# Altium schematic sheet USB-ESP32.SchDoc
size B
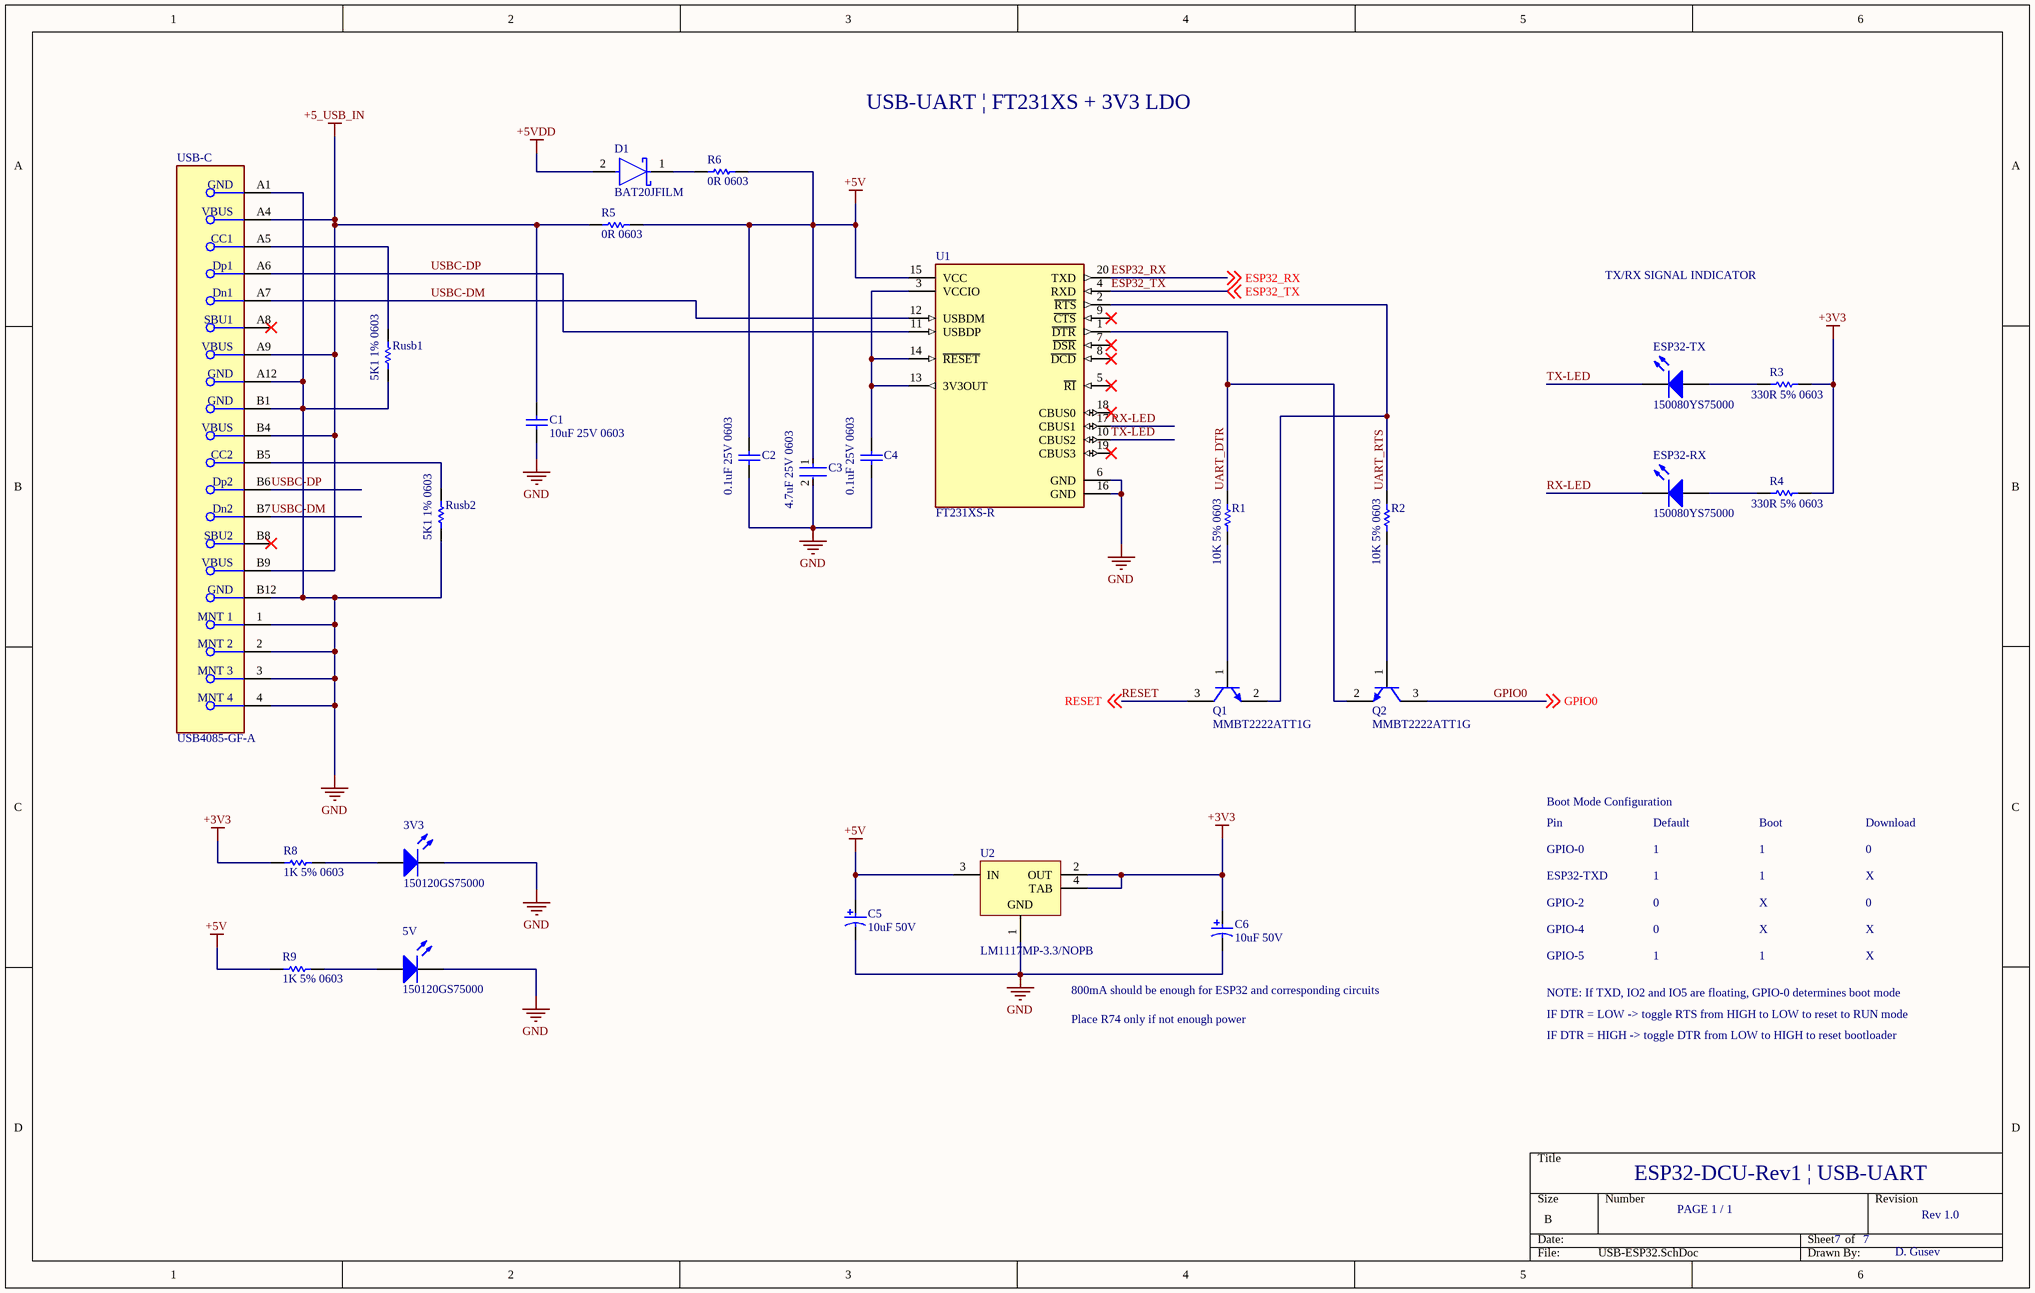
[diagram p0: USB-ESP32.SchDoc]

## Parts
3V3  150120GS75000  [1206_A]
5V  150120GS75000  [1206_A]
C1  10uF 25V 0603  [CAPC1608X100X20VL10T10]
C2  0.1uF 25V 0603  [CAPC1608X90X35LL10T15]
C3  4.7uF 25V 0603  [FP-GRM188-0_15-IPC_C]
C4  0.1uF 25V 0603  [CAPC1608X90X35LL10T15]
C5  10uF 50V  [PNSC-FK-V-D_V]
C6  10uF 50V  [PNSC-FK-V-D_V]
D1  BAT20JFILM  [FP-BAT20JFILM-MFG]
ESP32-RX  150080YS75000  [0805_A]
ESP32-TX  150080YS75000  [0805_A]
Q1  MMBT2222ATT1G  [ONSC-SC-75-3-463-01_V]
Q2  MMBT2222ATT1G  [ONSC-SC-75-3-463-01_V]
R1  10K 5% 0603  [RESC1608X55X25ML10T15]
R2  10K 5% 0603  [RESC1608X55X25ML10T15]
R3  330R 5% 0603  [RESC1608X55X25NL10T15]
R4  330R 5% 0603  [RESC1608X55X25NL10T15]
R5  0R 0603  [RESC1608X55X25ML10T15]
R6  0R 0603  [RESC1608X55X25ML10T15]
R8  1K 5% 0603  [RESC1608X55X25NL10T15]
R9  1K 5% 0603  [RESC1608X55X25NL10T15]
Rusb1  5K1 1% 0603  [RESC1608X55X25ML10T15]
Rusb2  5K1 1% 0603  [RESC1608X55X25ML10T15]
U1  FT231XS-R  [FP-SSOP-20-MFG]
U2  LM1117MP-3.3/NOPB  [DCY0004A_L]
USB-C  USB4085-GF-A  [FP-USB4085-GF-A-MFG]

## Nets
+3V3: C6.1 R3.2 R4.2 R8.1 U2.2(OUT) U2.4(TAB)
+5_USB_IN: C1.2 R5.1 USB-C.A4(VBUS) USB-C.A9(VBUS) USB-C.B4(VBUS) USB-C.B9(VBUS)
+5V: C2.2 C3.1 C5.1 R5.2 R6.2 R9.1 U1.15(VCC) U2.3(IN)
+5VDD: D1.2(A)
GND: 3V3.1(K) 5V.1(K) C1.1 C2.1 C3.2 C4.1 C5.2 C6.2 Rusb1.1 Rusb2.1 U1.6(GND) U1.16(GND) U2.1(GND) USB-C.1(MNT_1) USB-C.2(MNT_2) USB-C.3(MNT_3) USB-C.4(MNT_4) USB-C.A1(GND) USB-C.A12(GND) USB-C.B1(GND) USB-C.B12(GND)
ESP32_RX: U1.20(TXD) ; off-sheet ESP32_RX
ESP32_TX: U1.4(RXD) ; off-sheet ESP32_TX
GPIO0: Q2.3(C) ; off-sheet GPIO0
RESET: Q1.3(C) ; off-sheet RESET
RX-LED: ESP32-RX.1(K) U1.17(CBUS1)
TX-LED: ESP32-TX.1(K) U1.10(CBUS2)
UART_DTR: Q2.2(E) R1.2 U1.1(~{DTR})
UART_RTS: Q1.2(E) R2.2 U1.2(~{RTS})
USBC-DM: U1.12(USBDM) USB-C.A7(Dn1) USB-C.B7(Dn2)
USBC-DP: U1.11(USBDP) USB-C.A6(Dp1) USB-C.B6(Dp2)
Net3V3_2: 3V3.2(A) R8.2
Net5V_2: 5V.2(A) R9.2
NetC4_2: C4.2 U1.3(VCCIO) U1.13(3V3OUT) U1.14(~{RESET})
NetD1_1: D1.1(K) R6.1
NetESP32-RX_2: ESP32-RX.2(A) R4.1
NetESP32-TX_2: ESP32-TX.2(A) R3.1
NetQ1_1: Q1.1(B) R1.1
NetQ2_1: Q2.1(B) R2.1
NetRusb1_2: Rusb1.2 USB-C.A5(CC1)
NetRusb2_2: Rusb2.2 USB-C.B5(CC2)

Not connected (* = marked no-connect by the designer): U1 5(~{RI})* 7(~{DSR})* 8(~{DCD})* 9(~{CTS})* 18(CBUS0)* 19(CBUS3)*; USB-C A8(SBU1)* B8(SBU2)*

## Notes on the sheet
- USB-UART | FT231XS + 3V3 LDO
- TX/RX SIGNAL INDICATOR
- Boot Mode Configuration
- Pin
- Default
- Boot
- Download
- GPIO-0
- ESP32-TXD
- GPIO-2
- 1
- 0
- X
- GPIO-4
- GPIO-5
- 800mA should be enough for ESP32 and corresponding circuits
- Place R74 only if not enough power
- NOTE: If TXD, IO2 and IO5 are floating, GPIO-0 determines boot mode
- IF DTR = LOW -> toggle RTS from HIGH to LOW to reset to RUN mode
- IF DTR = HIGH -> toggle DTR from LOW to HIGH to reset bootloader
- ESP32-DCU-Rev1 | USB-UART
- PAGE 1 / 1
- 7
- Rev 1.0
- D. Gusev

## Library data of the parts
3V3 5V = CMP-1426-00014-1: SMD mono-color Chip LED, WL-SMCW, Green; Manufacturer: Wuerth Elektronik; PackageReference: 1206_A; PartNumber: 150120GS75000; ComponentLink1Description: Manufacturer URL; ComponentLink2URL: http://katalog.we-online.com/led/datasheet/150120GS75000.pdf; ComponentLink2Description: Datasheet; Color: Green; ComponentLink1URL: http://www.we-online.com
C1 = CMP-2000-05442-1: Chip Capacitor, 10 uF, +/- 20%, 25 V, -55 to 85 degC, 0603 (1608 Metric), RoHS, Tape and Reel; Manufacturer: TDK; PCN Part Number: MLCCPartNumberChange30/Nov/2012; Other Names: 445-9015-1; Capacitance: 10µF; Design Resources: 20WNon-IsolatedBuckLEDDriverUsingPLLNK460KG; Kits: 445-9014-KIT-ND-KITMLCC100PF-22UF060310-50V; Product Training Modules: SEAT,CCV,andTVCLDesignToolsGuidetoReplacinganElectrolyticCapacitorwithanMLCC; Online Catalog: CSeries,GeneralPurpose; Temperature Coefficient: X5R; Package Description: 2-Pin Surface Mount Device, Body 1.6 x 0.8 mm; Lead Style: -; Datasheet URL: http://download.siliconexpert.com/pdfs/2016/2/22/9/40/35/949/tdk_/manual/8010476609961980104703407078c1608x5r1e106m080ac.pdf.pdf; Category: Capacitors; Package / Case: 0603(1608Metric); Packaging: CutTape(CT); Series: C; Features: -; Family: CeramicCapacitors; Standard Package: 1; Tolerance: ±20%; Operating Temperature: -55degC~85degC; Mounting Type: SurfaceMount,MLCC; Ratings: -; Size / Dimension: 0.063"Lx0.031"W(1.60mmx0.80mm); Applications: GeneralPurpose; Package Reference: 1608; RoHS Information: RoHSCertificate-MLCC; Manufacturer URL: http://www.tdk.com/; Datasheet Version: Feb-16; Voltage - Rated: 25V; Height - Seated (Max): -; Thickness (Max): 0.039"(1.00mm); Lead Spacing: -
C2 C4 = CMP-2006-02868-1: Part Number: GRM188R71E104KA01D; Manufacturer: Murata
C3 = CMP-2006-02523-2: Chip Multilayer Ceramic Capacitors for General Purpose, 0603, 4.7uF, X5R, 15%, 10%, 25V; Case Code (Metric): 1608; Max Operating Temperature: 85°C; REACH SVHC: No SVHC; Voltage Rating: 25V; Dielectric: X5R; Packaging: Cut Tape; Width: 0.031inch; Min Operating Temperature: -55°C; Lead Free: Lead Free; Capacitance: 4.7uF; Height: 0.8mm; Case Code (Imperial): 0603; Length: 1.6mm; Voltage Rating (DC): 25V; Case/Package: 0603; Voltage: 25V; Tolerance: 10%; Thickness: 0.031inch; Mount: Surface Mount; Material: Ceramic; Package Quantity: 4000; Depth: 0.8mm
C5 C6 = CMP-2000-06207-1: Aluminum Electrolytic Capacitor, 10 uF, +/- 20%, 50 V, 2-Pin SMD (Size Code D), -55 to 105 degC, RoHS, Tape and Reel; Manufacturer: Panasonic; Lifetime@Temperature: 2000Hrs@105°C; Type: Can; Ripple Current: 165mA; Impedance: 0.88O; Capacitance: 10µF; Manufacturer URL: http://www.panasonic.com/; Mounting Technology: SurfaceMount; Rated Voltage: 50V; Datasheet URL: http://industrial.panasonic.com/cdbs/www-data/pdf/RDE0000/ABA0000C1181.pdf; Package Reference: FK-V-D; Series: FK; Operating Temp Range: -55to+105°C; Operating Temp-Max: 105°C; Datasheet Version: 03/2016; Package URL: http://industrial.panasonic.com/cdbs/www-data/pdf/RDE0000/DME0000COL48.pdf; Case Size/Dimension: Ø6.3x5.8mm; Package Description: 2-Pin Electrolytic Aluminum Capacitor, Body 6.6 x 6.6 mm
D1 = CMP-12187-000030-1: DIODE SCHOTTKY 23V 1A SOD323; Polarity: Standard; Element Configuration: Single; Capacitance: 30pF; Forward Voltage: 620mV; Max Surge Current: 5A; Peak Reverse Current: 12uA; Packaging: Tape and Reel; Weight: 0.01lb; Output Current: 1A; Lead Free: Lead Free; Forward Current: 1A; Mount: Surface Mount; Max Reverse Voltage (DC): 23V; Average Rectified Current: 1A; Max Operating Temperature: 150°C; Max Forward Surge Current (Ifsm): 5A; REACH SVHC: No SVHC; Current Rating: 1A; Length: 1.8mm; Radiation Hardening: No; Max Reverse Leakage Current: 12uA; Voltage Rating (DC): 23V; Height: 1.03mm; Peak Non-Repetitive Surge Current: 5A; Max Repetitive Reverse Voltage (Vrrm): 23V; Min Operating Temperature: -65°C; Number of Pins: 2; Width: 1.35mm; Package Quantity: 1
ESP32-RX ESP32-TX = CMP-1426-00012-1: SMD mono-color Chip LED, WL-SMCW, Yellow; Manufacturer: Wuerth Elektronik; Color: Yellow; ComponentLink1URL: http://www.we-online.com; PackageReference: 0805_A; ComponentLink2URL: http://katalog.we-online.com/led/datasheet/150080YS75000.pdf; ComponentLink1Description: Manufacturer URL; ComponentLink2Description: Datasheet; PartNumber: 150080YS75000
Q1 Q2 = CMP-1048-00417-1: General Purpose Transistor, NPN Silicon, 3-Pin SC-75, Pb-Free, Tape and Reel; Manufacturer: On Semiconductor; IC Continuous (A): 0.6; fT Min (MHz): 300; DatasheetVersion: Rev. 5; PackageVersion: Rev. F, 07/2005; ComponentLink1Description: Manufacturer URL; RoHS: TRUE; Packing: Tape and Reel; ComponentLink3URL: http://www.onsemi.com/pub_link/Collateral/463-01.PDF; ComponentLink1URL: http://www.onsemi.com/; ComponentLink3Description: Package Specification; ComponentLink2URL: http://www.onsemi.cn/pub_link/Collateral/MMBT2222ATT1-D.PDF; Mounting Technology: Surface Mount; PartNumber: MMBT2222ATT1G; ComponentLink2Description: Datasheet; Polarity: NPN; PackageReference: SC-75-3-463-01; PackageDescription: 3-Pin Small Outline Transistor, Body 1.6 x 0.8 mm, Pitch 0.5 mm
R1 R2 = CMP-2100-03664-1: Chip Resistor, 10 KOhm, +/- 1%, 01 W, -55 to 155 degC, 0603 (1608 Metric), RoHS, Tape and Reel; Manufacturer: Yageo; Temperature Coefficient: 100ppm/degreesC; Resistance: 10KOhm; Voltage Rating: 75V; Power Rating: 100mW; Voltage Rating (DC): 50V; Composition: ThickFilm; RoHSCompliant: true; Height: 0.45mm; Lead Free: LeadFree; Case Code (Metric): 1608; Case/Package: 0603; Datasheet Version: Rev. 5, 10/2016; Package Reference: 0603; Depth: 0.8mm; Package Description: 2-Pin Surface Mount Device, Body 1.6 x 0.8 mm; Case Code (Imperial): 0603; Packaging: TapeandReel; Termination: SMD/SMT; Lead Pitch: 0.3mm; Width: 0.8mm; Number of Pins: 2; Length: 1.6mm; REACH SVHC: NoSVHC; Military Standard: Not; Max Operating Temperature: 155degC; Min Operating Temperature: -55degC; Manufacturer URL: http://www.yageo.com/; Datasheet URL: http://www.yageo.com/NewPortal/yageodocoutput?fileName=/pdf/R-Chip/PYu-RC_Group_51_RoHS_L_5.pdf; Weight: 7.1E-05oz; Tolerance: 1%
R3 R4 = CMP-1659-00020-2: Chip Resistor, 330 Ohm, +/- 1%, 0.1 W, -55 to 155 degC, 0603 (1608 Metric), RoHS, Tape and Reel; Tolerance: 10%; ESR: 800 mohm; Voltage Rating (DC): 16 V; Capacitance: 47 uF; Length: 7.3 mm; ComponentLink1URL: http://www.yageo.com/; Packaging: Tape and Reel; Pins: 2; ComponentLink1Description: Manufacturer URL; Case Code (Imperial): 2917; REACH SVHC: No SVHC; Width: 4.3 mm; ComponentLink2Description: Datasheet; Voltage Rating: 16 V; RoHSCompliant: True; Max Operating Temperature: 125degC; ComponentLink2URL: http://www.yageo.com/documents/recent/PYu-RC_Group_51_RoHS_L_04.pdf; Min Operating Temperature: -55degC; Case/Package: 2917; Radiation Hardening: No; DatasheetVersion: Rev. 4, 02/2016; Mount: Surface Mount; PackageReference: 0603; Package Quantity: 500; Case Code (Metric): 7343; PackageDescription: 2-Pin Surface Mount Device, Body 1.6 x 0.8 mm; Height: 3.1 mm
R5 R6 = CMP-2100-03667-1: Chip Resistor, 0 Ohm, +/- 5%, 0.1 W, -55 to 155 degC, 0603 (1608 Metric), RoHS, Tape and Reel; Manufacturer: Yageo; Temperature Coefficient: 200ppm/degreesC; Voltage Rating: 50V; Power Rating: 100mW; Resistance: 0mOhm; Width: 0.8mm; Max Operating Temperature: 155degC; Tolerance: 5%; Package Reference: 0603; Height: 0.45mm; Depth: 0.8mm; Package Description: 2-Pin Surface Mount Device, Body 1.6 x 0.8 mm; Termination: SMD/SMT; Package Quantity: 5000; Case/Package: 0603; Case Code (Imperial): 0603; Radiation Hardening: No; Number of Pins: 2; Length: 1.6mm; Lead Free: LeadFree; Voltage Rating (DC): 50V; Military Standard: Not; Datasheet URL: http://www.yageo.com/NewPortal/yageodocoutput?fileName=/pdf/R-Chip/PYu-RC_Group_51_RoHS_L_5.pdf; Manufacturer URL: http://www.yageo.com/; Packaging: TapeandReel; Case Code (Metric): 1608; Min Operating Temperature: -55degC; Composition: ThickFilm; RoHSCompliant: true; Contact Plating: Tin; Datasheet Version: Rev. 5, 10/2016; REACH SVHC: NoSVHC
R8 R9 = CMP-1659-00009-4: Chip Resistor, 1 KOhm, +/-1%, 0.1 W, -55 to 155 degC, 0603 (1608 Metric), RoHS, Tape and Reel; Manufacturer: Yageo; Voltage Rating: 50 V; ComponentLink2URL: http://www.yageo.com/documents/recent/PYu-RC_Group_51_RoHS_L_04.pdf; Max Operating Temperature: 155 degC; PackageDescription: 2-Pin Surface Mount Device, Body 1.6 x 0.8 mm; Packaging: Tape and Reel; ComponentLink3Description: Package Specification; REACH SVHC: No SVHC; Mount: Surface Mount; ComponentLink2Description: Datasheet; Length: 1.6 mm; PackageReference: 0603; Height: 0.45 mm; DatasheetVersion: Rev. 4, 02/2016; Min Operating Temperature: -55 degC; ComponentLink1Description: Manufacturer URL; Package Quantity: 200; RoHSCompliant: true; ComponentLink3URL: http://www.farnell.com/datasheets/443971.pdf; Pins: 2; Mounting Technology: Surface Mount; ComponentLink1URL: http://www.yageo.com/
Rusb1 Rusb2 = CMP-2000-04091-1: Manufacturer: Yageo; Part Number: RC0603FR-075K1L
U1 = CMP-0248-00024-3: IC USB SERIAL FULL UART 20SSOP; Operating Supply Voltage: 5V; Operating Supply Current: 8mA; Number of Channels: 1; Min Supply Voltage: 2.97V; Max Supply Voltage: 5.5V; Data Rate: 12Mbps; Height: 0.059inch; Packaging: Tape and Reel; Mount: Surface Mount; Package Quantity: 2000; Radiation Hardening: No; Case/Package: SSOP; Min Operating Temperature: -40°C; Width: 0.157inch; Number of Pins: 20; Weight: 0.016oz; Interface: UART; Max Operating Temperature: 85°C; Length: 8.74mm
U2 = CMP-0062-01638-4: 800mA Low-Dropout Linear Regulator, 4-pin SOT-223, Pb-Free; Manufacturer: Texas Instruments; CompType: LDO IC; PackageTopMarking: XYTT*N05A; High-Reliability: Y; PowerWise: N; ComponentLink1URL: http://www.ti.com/general/docs/lit/getliterature.tsp?genericPartNumber=LM1117-N&fileType=pdf; PinCount: 4; PackageDescription: Molded SOT-223, 6.50 x 3.56 x 1.6mm Body, 4 Lead, 2.3mm Pitch; Code_IPC: SOT223-4; PartNumber: LM1117MP-3.3/NOPB; Code_JEDEC: TO-261-AA; RoHS: Y; PackageReference: DCY0004A; ComponentLink1Description: Datasheet URL
USB-C = CMP-196119-000001-1: CONN RCPT USB2.0 TYPEC 16POS; Manufacturer: Global Connector Technology; Voltage Rating: 20V; Conn Orientation: Right Angle; Shielding: true; Current Rating: 4.25A; Number Of Contacts: 16; Pitch: 0.85mm; Is Female: yes; ComponentLink2URL: https://gct.co/files/drawings/usb4085.pdf; Category: Conn; Automotive: No; ComponentLink2Description: Datasheet; Height: 3.66mm; Manufacturer Part Number: USB4085-GF-A; Package: 0; Usb Standard: USB 2.0; Octopart: https://octopart.com/usb4085-gf-a-global+connector+technology-94773699; Device Class L3: unset; Digikey Description: CONN RCPT USB2.0 TYPEC 16POS; Temperature Range Low: -40°C; Temperature: -40°C to +85°C; Lead Free: Yes; Contact Material: Gold,Nickel; Device Class L1: Connectors; Temperature Range High: +85°C; Device Class L2: USB Connectors; RoHS: TRUE